# Altium schematic sheet HRM.SchDoc
size A4
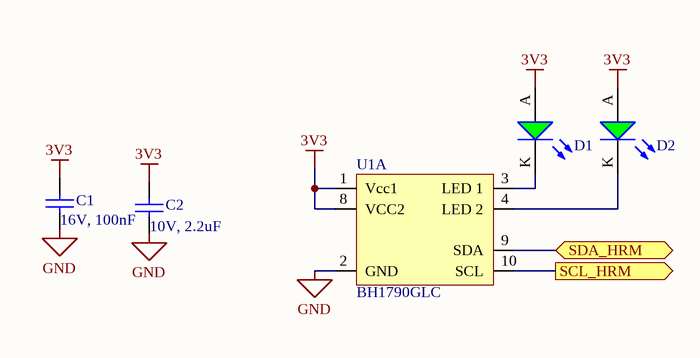
[diagram p0: HRM.SchDoc]

## Parts
C1  16V, 100nF  [0603_1.6x0.8x0.8mm_Reflow Soldering]
C2  10V, 2.2uF  [0603_1.6x0.8x0.8mm_Reflow Soldering]
D1  Bright Green, 2V, 140°  [WL-SMCW_0603_150060xx75003]  (value not drawn)
D2  Bright Green, 2V, 140°  [WL-SMCW_0603_150060xx75003]  (value not drawn)
U1  BH1790GLC  [WLGA010V28_ROHM]  (part A of 2)

## Ports
SCL_HRM (out), SDA_HRM (bidir)

## Nets
3V3: C1.2 C2.2 D1.A D2.A U1.1(Vcc1) U1.8(VCC2)
GND: C1.1 C2.1 U1.2(GND)
SCL_HRM: U1.10(SCL) ; port SCL_HRM
SDA_HRM: U1.9(SDA) ; port SDA_HRM
NetD1_K: D1.K U1.3(LED_1)
NetD2_K: D2.K U1.4(LED_2)

## Library data of the parts
C1 = 885012206046: WCAP-CSGP Ceramic Capacitors, 0603, X7R, 16V, 100nF; Rated Voltage: 16V DC; ComponentLink1Description: Manufacturer; ComponentLink1URL: http://www.we-online.de; ComponentLink2Description: Datasheet; ComponentLink2URL: http://katalog.we-online.de/pbs/datasheet/885012206046.pdf; Part Number: 885012206046; Published Date: Oct. 2017; Publisher: Wurth Elektronik; Size: 0603; Operating Temperature: -55 °C to +125 °C; Value: 100nF; Ceramic Type: X7R
C2 = 885012206027: WCAP-CSGP Ceramic Capacitors, 0603, X7R, 10V, 2.2uF; Rated Voltage: 10V DC; ComponentLink1Description: Manufacturer; ComponentLink1URL: http://www.we-online.de; ComponentLink2Description: Datasheet; ComponentLink2URL: http://katalog.we-online.de/pbs/datasheet/885012206027.pdf; Part Number: 885012206027; Published Date: Oct. 2017; Publisher: Wurth Elektronik; Size: 0603; Operating Temperature: -55 °C to +125 °C; Value: 2.2uF; Ceramic Type: X7R
D1 D2 = 150060VS75003: WL-SMCW Mono-color Chip LED Waterclear, SMT, size 0603, Bright Green, 2V, 140°; Manufacturer: Wurth Elektronik; Case/Size Code: 0603; Chip Technology: AlInGaP; Dominant Wavelength: 570nm; Luminous Intensity: 100mcd; Peak Wavelength: 572nm; Manufacturer Part Number: 150060VS75003; Category: Signal LEDs; Match Code: WL-SMCW; ComponentLink1Description: Website Link; ComponentLink1URL: https://www.we-online.com/redexpert/article/150060VS75003?ad; ComponentLink2Description: Datasheet Link; ComponentLink2URL: https://www.we-online.com/redexpert/spec/150060VS75003?ad; Mount: Surface Mount; Operating Temperature Max: 100°C; Operating Temperature Min: -40°C; Packaging: Tape and Reel; Length: 1.6mm; Width: 0.8mm; Height: 0.7mm; Emitting Color: Bright Green; Forward Voltage: 2V; Viewing Angle: 140°
U1 = BH1790GLC: Optical Sensor for Heart Rate Monitor IC